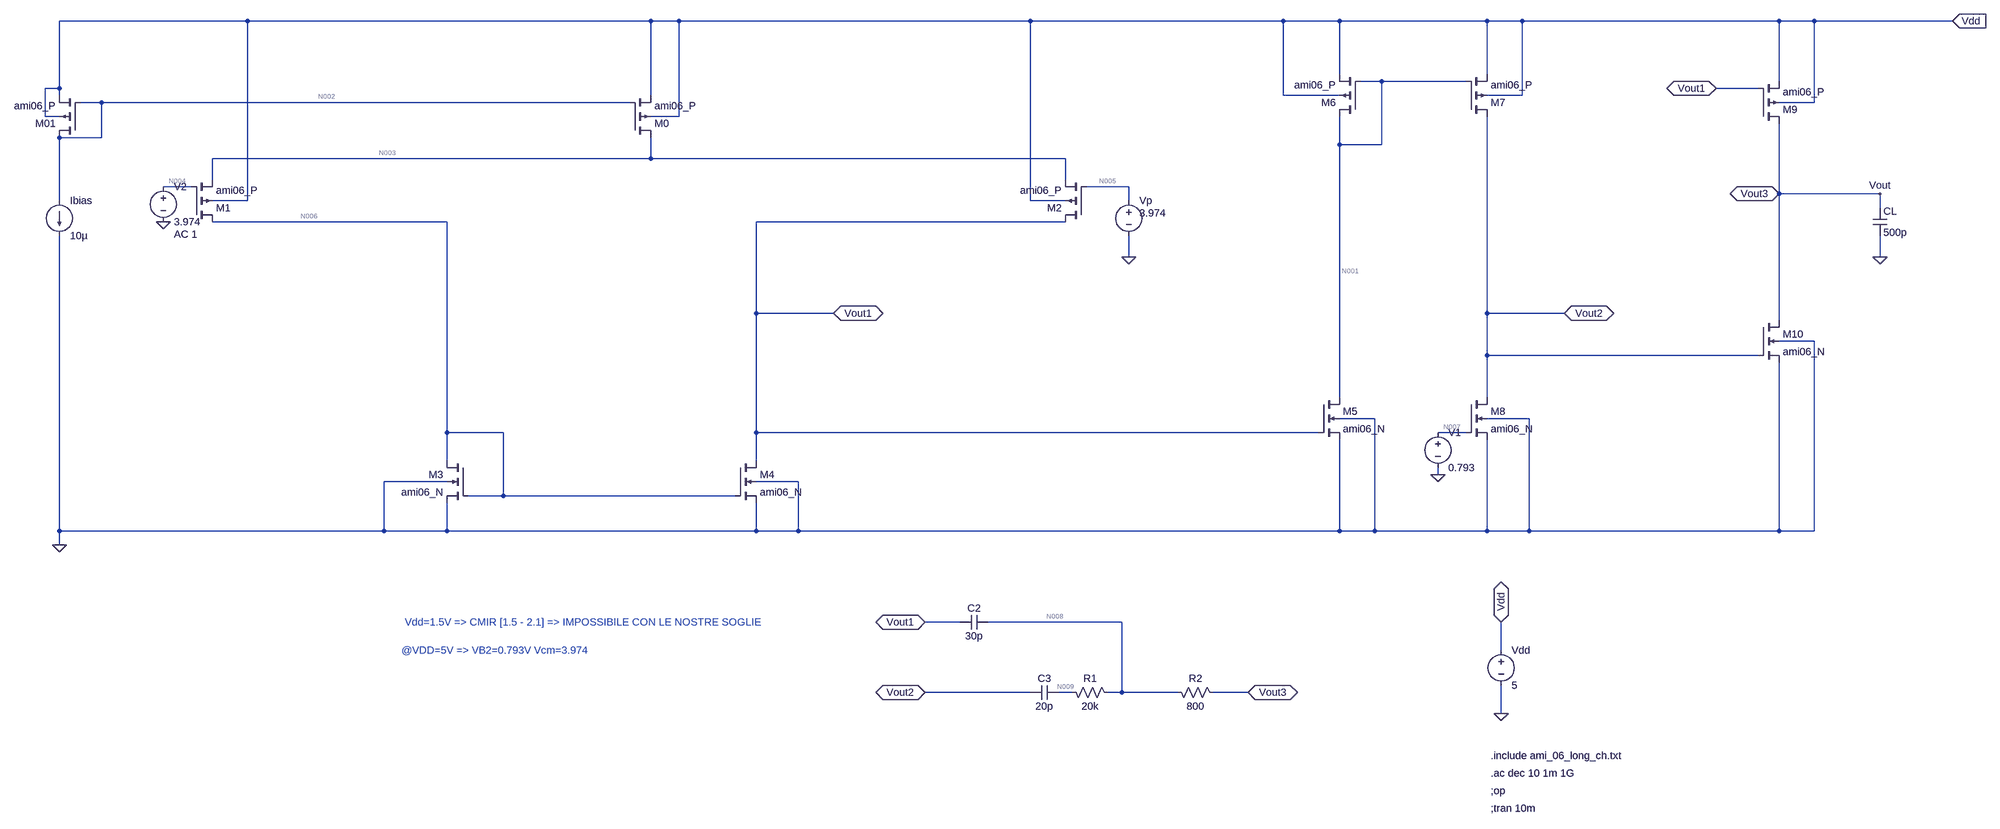
[diagram p0: schematic Real_three_stage_CMOS_OTA.asc]
Real_three_stage_CMOS_OTA.asc, the LTspice schematic file:
Version 4
SHEET 1 5820 1952
WIRE -560 -128 -1072 -128
WIRE 560 -128 -560 -128
WIRE 624 -128 560 -128
WIRE 1424 -128 624 -128
WIRE 2000 -128 1424 -128
WIRE 2128 -128 2000 -128
WIRE 2464 -128 2128 -128
WIRE 2544 -128 2464 -128
WIRE 3136 -128 2544 -128
WIRE 3216 -128 3136 -128
WIRE 4544 -128 3216 -128
WIRE 2128 0 2128 -128
WIRE 2464 0 2464 -128
WIRE 2224 16 2176 16
WIRE 2416 16 2224 16
WIRE 3136 16 3136 -128
WIRE -1072 32 -1072 -128
WIRE -1072 32 -1104 32
WIRE 3088 32 2992 32
WIRE -1072 48 -1072 32
WIRE 560 48 560 -128
WIRE 2000 48 2000 -128
WIRE 2128 48 2000 48
WIRE 2544 48 2544 -128
WIRE 2544 48 2464 48
WIRE -976 64 -1024 64
WIRE 512 64 -976 64
WIRE 3216 64 3216 -128
WIRE 3216 64 3136 64
WIRE -1104 96 -1104 32
WIRE -1072 96 -1104 96
WIRE 624 96 624 -128
WIRE 624 96 560 96
WIRE -976 144 -976 64
WIRE -976 144 -1072 144
WIRE 2128 160 2128 96
WIRE 2224 160 2224 16
WIRE 2224 160 2128 160
WIRE 560 192 560 144
WIRE 560 192 -640 192
WIRE 1504 192 560 192
WIRE -640 240 -640 192
WIRE 1504 240 1504 192
WIRE -688 256 -752 256
WIRE 1648 256 1552 256
WIRE 3136 272 3136 112
WIRE 3792 272 3136 272
WIRE -1072 288 -1072 144
WIRE -560 288 -560 -128
WIRE -560 288 -640 288
WIRE 1424 288 1424 -128
WIRE 1504 288 1424 288
WIRE 1648 288 1648 256
WIRE 3792 304 3792 272
WIRE 96 336 -640 336
WIRE 1504 336 800 336
WIRE 1648 416 1648 368
WIRE 3792 416 3792 368
WIRE 800 544 800 336
WIRE 976 544 800 544
WIRE 2464 544 2464 96
WIRE 2640 544 2464 544
WIRE 3136 560 3136 272
WIRE 3216 608 3136 608
WIRE 2464 640 2464 544
WIRE 3088 640 2464 640
WIRE 2128 736 2128 160
WIRE 2464 736 2464 640
WIRE 2208 784 2128 784
WIRE 2560 784 2464 784
WIRE 96 816 96 336
WIRE 224 816 96 816
WIRE 800 816 800 544
WIRE 2080 816 800 816
WIRE 2416 816 2352 816
WIRE 96 880 96 816
WIRE 800 880 800 816
WIRE 2352 912 2352 896
WIRE 96 928 -48 928
WIRE 896 928 800 928
WIRE 224 960 224 816
WIRE 224 960 144 960
WIRE 752 960 224 960
WIRE -1072 1040 -1072 368
WIRE -48 1040 -48 928
WIRE -48 1040 -1072 1040
WIRE 96 1040 96 976
WIRE 96 1040 -48 1040
WIRE 800 1040 800 976
WIRE 800 1040 96 1040
WIRE 896 1040 896 928
WIRE 896 1040 800 1040
WIRE 2128 1040 2128 832
WIRE 2128 1040 896 1040
WIRE 2208 1040 2208 784
WIRE 2208 1040 2128 1040
WIRE 2464 1040 2464 832
WIRE 2464 1040 2208 1040
WIRE 2560 1040 2560 784
WIRE 2560 1040 2464 1040
WIRE 3136 1040 3136 656
WIRE 3136 1040 2560 1040
WIRE 3216 1040 3216 608
WIRE 3216 1040 3136 1040
WIRE -1072 1072 -1072 1040
WIRE 1264 1248 1184 1248
WIRE 1632 1248 1328 1248
WIRE 2496 1312 2496 1248
WIRE 1424 1408 1184 1408
WIRE 1520 1408 1488 1408
WIRE 1632 1408 1632 1248
WIRE 1632 1408 1600 1408
WIRE 1760 1408 1632 1408
WIRE 1920 1408 1840 1408
WIRE 2496 1456 2496 1392
FLAG -1072 1072 0
FLAG 976 544 Vout1
IOPIN 976 544 BiDir
FLAG 2640 544 Vout2
IOPIN 2640 544 BiDir
FLAG 2992 32 Vout1
IOPIN 2992 32 BiDir
FLAG 4544 -128 Vdd
IOPIN 4544 -128 In
FLAG 3792 416 0
FLAG 1920 1408 Vout3
IOPIN 1920 1408 BiDir
FLAG 1184 1248 Vout1
IOPIN 1184 1248 BiDir
FLAG 1184 1408 Vout2
IOPIN 1184 1408 BiDir
FLAG 2496 1456 0
FLAG 2496 1248 Vdd
IOPIN 2496 1248 BiDir
FLAG 2352 912 0
FLAG 1648 416 0
FLAG 3136 272 Vout3
IOPIN 3136 272 BiDir
FLAG 3792 272 Vout
FLAG -752 336 0
SYMBOL pmos4 -1024 144 R180
SYMATTR InstName M01
SYMATTR Value2 l=1.65u w=66u
SYMATTR Value ami06_P
SYMBOL current -1072 288 R0
WINDOW 123 0 0 Left 0
WINDOW 39 0 0 Left 0
SYMATTR InstName Ibias
SYMATTR Value 10µ
SYMBOL nmos4 144 880 M0
SYMATTR InstName M3
SYMATTR Value2 l=1.2u w=68.6u
SYMATTR Value ami06_N
SYMBOL nmos4 752 880 R0
SYMATTR InstName M4
SYMATTR Value2 l=1.2u w=68.6u
SYMATTR Value ami06_N
SYMBOL pmos4 2176 96 R180
SYMATTR InstName M6
SYMATTR Value2 l=1.2u w=85.7u
SYMATTR Value ami06_P
SYMBOL pmos4 2416 96 M180
SYMATTR InstName M7
SYMATTR Value2 l=1.2u w=85.7u
SYMATTR Value ami06_P
SYMBOL nmos4 2416 736 R0
SYMATTR InstName M8
SYMATTR Value2 l=1.65u w=66u
SYMATTR Value ami06_N
SYMBOL pmos4 512 144 M180
SYMATTR InstName M0
SYMATTR Value2 l=1.65u w=66u m=2
SYMATTR Value ami06_P
SYMBOL cap 3776 304 R0
SYMATTR InstName CL
SYMATTR Value 500p
SYMBOL cap 1328 1232 R90
WINDOW 0 0 32 VBottom 2
WINDOW 3 32 32 VTop 2
SYMATTR InstName C2
SYMATTR Value 30p
SYMBOL cap 1488 1392 R90
WINDOW 0 0 32 VBottom 2
WINDOW 3 32 32 VTop 2
SYMATTR InstName C3
SYMATTR Value 20p
SYMBOL res 1504 1392 M90
WINDOW 0 0 56 VBottom 2
WINDOW 3 32 56 VTop 2
SYMATTR InstName R1
SYMATTR Value 20k
SYMBOL res 1744 1392 M90
WINDOW 0 0 56 VBottom 2
WINDOW 3 32 56 VTop 2
SYMATTR InstName R2
SYMATTR Value 800
SYMBOL voltage 2496 1296 R0
WINDOW 123 0 0 Left 0
WINDOW 39 0 0 Left 0
SYMATTR InstName Vdd
SYMATTR Value 5
SYMBOL voltage 2352 800 R0
WINDOW 123 0 0 Left 0
WINDOW 39 0 0 Left 0
SYMATTR InstName V1
SYMATTR Value 0.793
SYMBOL voltage 1648 272 R0
WINDOW 123 24 124 Left 2
WINDOW 39 0 0 Left 0
WINDOW 3 24 44 Left 2
SYMATTR Value 3.974
SYMATTR InstName Vp
SYMBOL pmos4 -688 336 M180
SYMATTR InstName M1
SYMATTR Value2 l=1.65u w=66u m=4
SYMATTR Value ami06_P
SYMBOL pmos4 1552 336 R180
SYMATTR InstName M2
SYMATTR Value2 l=1.65u w=66u m=4
SYMATTR Value ami06_P
SYMBOL nmos4 2080 736 R0
SYMATTR InstName M5
SYMATTR Value2 l=1.2u w=68.6u m=2
SYMATTR Value ami06_N
SYMBOL nmos4 3088 560 R0
SYMATTR InstName M10
SYMATTR Value2 l=1.2u w=68.6u m=8
SYMATTR Value ami06_N
SYMBOL pmos4 3088 112 M180
SYMATTR InstName M9
SYMATTR Value2 l=1.2u w=68.6u m=4
SYMATTR Value ami06_P
SYMBOL voltage -752 240 R0
WINDOW 123 24 124 Left 2
WINDOW 39 0 0 Left 0
SYMATTR Value2 AC 1
SYMATTR InstName V2
SYMATTR Value 3.974
TEXT 2472 1592 Left 2 !.ac dec 10 1m 1G
TEXT 2472 1632 Left 2 !;op
TEXT 2472 1672 Left 2 !;tran 10m
TEXT -8 1312 Left 2 ;@VDD=5V => VB2=0.793V Vcm=3.974
TEXT 2472 1552 Left 2 !.include ami_06_long_ch.txt
TEXT 0 1248 Left 2 ;Vdd=1.5V => CMIR [1.5 - 2.1] => IMPOSSIBILE CON LE NOSTRE SOGLIE

The netlist it stands for:
* Real_three_stage_CMOS_OTA.asc
M01 N002 N002 Vdd Vdd ami06_P l=1.65u w=66u
Ibias N002 0 10µ
M3 N006 N006 0 0 ami06_N l=1.2u w=68.6u
M4 Vout1 N006 0 0 ami06_N l=1.2u w=68.6u
M6 N001 N001 Vdd Vdd ami06_P l=1.2u w=85.7u
M7 Vout2 N001 Vdd Vdd ami06_P l=1.2u w=85.7u
M8 Vout2 N007 0 0 ami06_N l=1.65u w=66u
M0 N003 N002 Vdd Vdd ami06_P l=1.65u w=66u m=2
CL Vout 0 500p
C2 N008 Vout1 30p
C3 N009 Vout2 20p
R1 N009 N008 20k
R2 N008 Vout 800
Vdd Vdd 0 5
V1 N007 0 0.793
Vp N005 0 3.974
M1 N006 N004 N003 Vdd ami06_P l=1.65u w=66u m=4
M2 Vout1 N005 N003 Vdd ami06_P l=1.65u w=66u m=4
M5 N001 Vout1 0 0 ami06_N l=1.2u w=68.6u m=2
M10 Vout Vout2 0 0 ami06_N l=1.2u w=68.6u m=8
M9 Vout Vout1 Vdd Vdd ami06_P l=1.2u w=68.6u m=4
V2 N004 0 3.974 AC 1
.model NMOS NMOS
.model PMOS PMOS
.lib standard.mos
.ac dec 10 1m 1G
;op
;tran 10m
* @VDD=5V => VB2=0.793V Vcm=3.974
.include ami_06_long_ch.txt
* Vdd=1.5V => CMIR [1.5 - 2.1] => IMPOSSIBILE CON LE NOSTRE SOGLIE
.backanno
.end

* Results of the author's LTspice run, read from the files saved beside the schematic
* Operating Point, zero values left out:
*   V(n002) = 3.981 V
*   V(vdd) = 5 V
*   V(n006) = 676 mV
*   V(vout1) = 676 mV
*   V(n001) = 3.977 V
*   V(vout2) = 1.942 V
*   V(n007) = 793 mV
*   V(n003) = 4.91 V
*   V(vout) = 1.618 V
*   V(n008) = 1.618 V
*   V(n009) = 1.618 V
*   V(n005) = 3.974 V
*   V(n004) = 3.974 V
*   Id(M10) = 28.07 mA
*   Ib(M10) = -13.03 pA
*   Is(M10) = -28.07 mA
*   Id(M5) = 22.6 µA
*   Ib(M5) = -7.973 pA
*   Is(M5) = -22.6 µA
*   Id(M8) = 29.78 µA
*   Ib(M8) = -1.952 pA
*   Is(M8) = -29.78 µA
*   Id(M4) = 7.91 µA
*   Is(M4) = -7.91 µA
*   Id(M3) = 7.91 µA
*   Is(M3) = -7.91 µA
*   Id(M9) = -28.07 mA
*   Ib(M9) = 13.57 pA
*   Is(M9) = 28.07 mA
*   Id(M2) = -7.91 µA
*   Ib(M2) = 17.74 pA
*   Is(M2) = 7.91 µA
*   Id(M1) = -7.91 µA
*   Ib(M1) = 17.74 pA
*   Is(M1) = 7.91 µA
*   Id(M0) = -15.82 µA
*   Is(M0) = 15.82 µA
*   Id(M7) = -29.78 µA
*   Ib(M7) = 3.068 pA
*   Is(M7) = 29.78 µA
*   Id(M6) = -22.6 µA
*   Ib(M6) = 1.033 pA
*   Is(M6) = 22.6 µA
*   Id(M01) = -10 µA
*   Ib(M01) = 1.029 pA
*   Is(M01) = 10 µA
*   I(Ibias) = 10 µA
*   I(Vdd) = -28.15 mA